# Altium schematic sheet 12V适配器部分_无线发射端.SchDoc
size A4
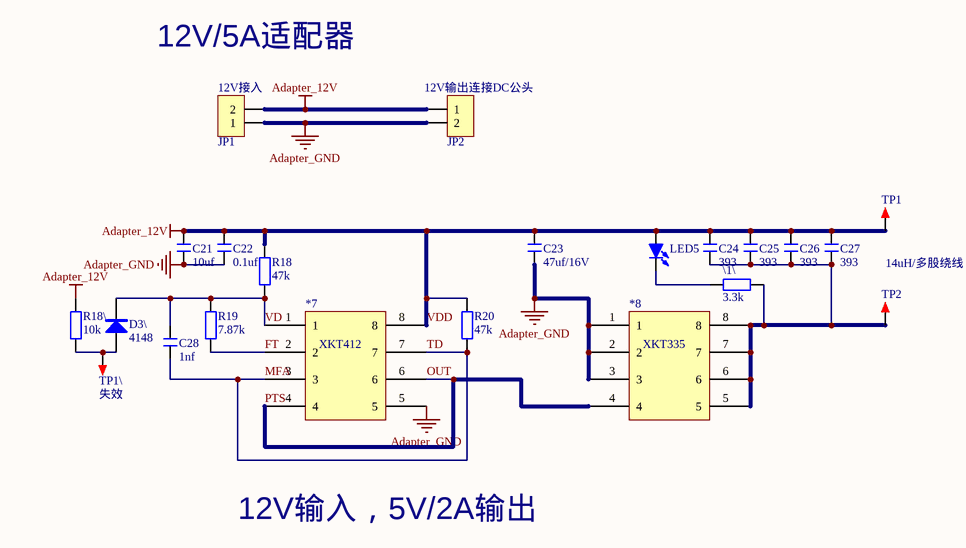
[diagram p0: 12V适配器部分_无线发射端.SchDoc]

## Parts
*7  XKT412  [SOP8_M]
*8  XKT335  [SOP8_M]
\1\  3.3k  [R 0805_M]
C21  10uf  [C 0805_M]
C22  0.1uf  [C 0805_M]
C23  47uf/16V  [C 1206_L]
C24  393  [C 0805_M]
C25  393  [C 0805_M]
C26  393  [C 0805_M]
C27  393  [C 0805_M]
C28  1nf  [C 0805_M]
D3\  4148  [SOD-123F]
JP1  12V接入  [KF301-5.0-2P]
JP2  12V输出连接DC公头  [KF301-5.0-2P]
LED5  WireLess_on  [LED 0805G]  (value not drawn)
R18  47k  [R 0805_M]
R18\  10k  [R 0805_M]
R19  7.87k  [R 0805_M]
R20  47k  [R 0805_M]
TP1  14uH/多股绕线  [TEST 2.0]
TP1\  失效  [TEST 2.0]
TP2  14uH/多股绕线  [TEST 2.0]  (value not drawn)

## Nets
Adapter_GND: *7.5 *8.1 *8.2 *8.3 C21.1 C22.1 C23.1 JP1.1 JP2.2
VDD: *7.8 C21.2 C22.2 C23.2 C24.2 C25.2 C26.2 C27.2 JP1.2 JP2.1 LED5.1(A) R18.1 R18\.1 R20.1 TP1.1  [also labelled Adapter_12V]
FT: *7.2 R19.2
MFA: *7.3 *7.7 C28.1 R20.2  [also labelled TD]
OUT: *7.4 *7.6 *8.4  [also labelled PTS]
VD: *7.1 C28.2 D3\.2(K) R18.2 R19.1
Net*8_5: *8.5 *8.6 *8.7 *8.8 \1\.1 C24.1 C25.1 C26.1 C27.1 TP2.1
Ne~{t1}_2: \1\.2 LED5.2(K)
NetD~{3}_1: D3\.1(A) R18\.2 TP1\.1

## Notes on the sheet
- 12V/5A适配器
- 12V输入，5V/2A输出

## Library data of the parts
*7 *8 = 8
\1\ R18 R18\ R19 R20 = R: 贴片电阻; 版权归属: 源创客; BOM名称: 贴片电阻; 学习资源: www.ooocke.com
C21-C28 = C: 无极性贴片电容; 版权归属: 源创客; BOM名称: 无极性贴片电容; 学习资源: www.ooocke.com
D3\ = SS34: 肖特基二极管; 版权归属: 源创客; 属性: 40V/3A; BOM名称: 肖特基二极管; 学习资源: www.ooocke.com
JP1 JP2 = Header 2: 2P接插件; 版权归属: 源创客; BOM名称: 2P接插件; 学习资源: www.ooocke.com
LED5 = LED-SMD: 贴片LED; 版权归属: 源创客; BOM名称: 贴片LED; 学习资源: www.ooocke.com
TP1 TP1\ TP2 = TEST: 测试点; 版权归属: 源创客; BOM名称: 测试点; 学习资源: www.ooocke.com